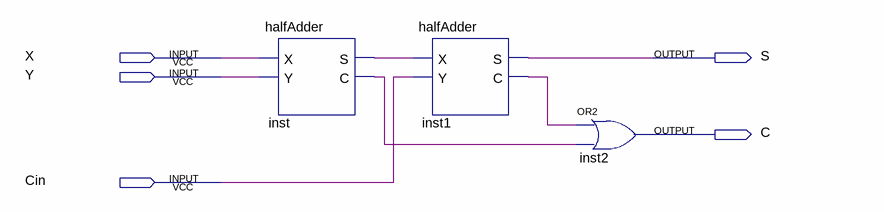
[diagram p0: schematic sheet]
// Quartus schematic fullAdder.bdf as structural Verilog: 3 symbols, 5 pins
module fullAdder (
  input  X,
  input  Y,
  input  Cin,
  output S,
  output C
);

  wire inst1_c, inst_c, inst_s;

  halfAdder inst (.X(X), .Y(Y), .S(inst_s), .C(inst_c));
  halfAdder inst1 (.X(inst_s), .Y(Cin), .S(S), .C(inst1_c));
  or inst2 (C, inst1_c, inst_c);
endmodule
